# Altium schematic sheet D737343.SchDoc
size 594 x 420 mm; CompanyName: АО "Диаконт"; SheetTotal: 1; PageSetup: Record=PageOptions|CenterHorizontal=False|CenterVertical=False|PrintScale=1.00|XCorrection=0.00|YCorrection=0.00|PrintKind=2|BorderSize=5000000|LeftOffset=0|BottomOffset=0|Orientation=2|PaperLength=1000|PaperWidth=1000|Scale=100|PaperSource=7|PrintQuality=300|MediaType=1|DitherType=10|PaperKind=A2|PrintScaleMode=0; DecimalNumber: ИТЦЯ.468353.038 Э3; HeadOfSector: Нач. сектора; MainDevice: ИТЦЯ.468353.038; Name1: Плата сопряжения; Name2: пирометра; Name: Наименование; SoglasGrafa: Соглас.
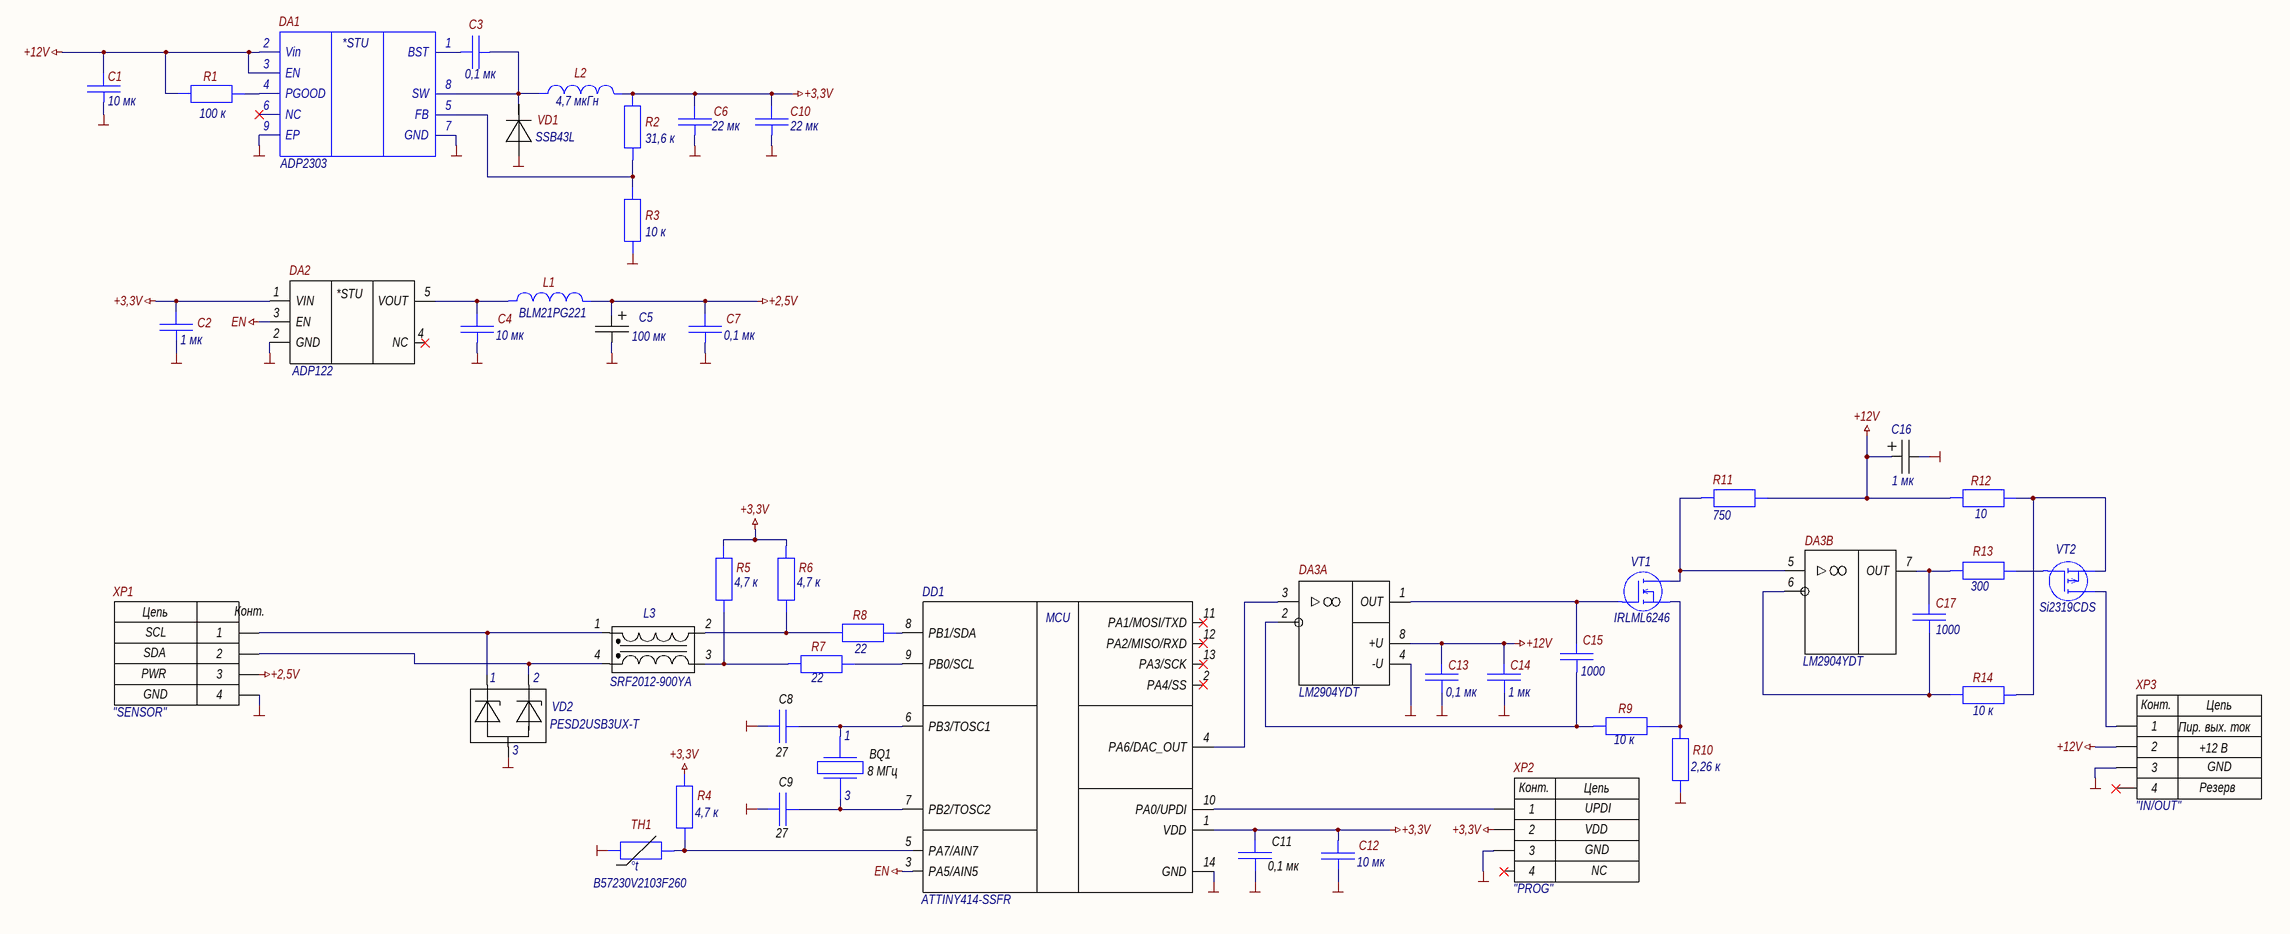
[diagram p0: D737343.SchDoc]

## Parts
BQ1  8 МГц  pinName1: 1  pinName3: 3
C1  10 мк
C2  1 мк
C3  0,1 мк
C4  10 мк
C5  100 мк
C6  22 мк
C7  0,1 мк
C8  27
C9  27
C10  22 мк
C11  0,1 мк
C12  10 мк
C13  0,1 мк
C14  1 мк
C15  1000
C16  1 мк
C17  1000
DA1  ADP2303  Function: *STU
DA2  ADP122
DA3  LM2904YDT  (parts A,B of 2)
DD1  ATTINY414-SSFR
L1  BLM21PG221
L2  value 4,7 мкГн  (hidden comment: 8RHB)
L3  SRF2012-900YA
R1  100 к
R2  31,6 к
R3  10 к
R4  4,7 к
R5  4,7 к
R6  4,7 к
R7  22
R8  22
R9  10 к
R10  2,26 к
R11  750
R12  10
R13  300
R14  10 к
TH1  B57230V2103F260
VD1  SSB43L
VD2  PESD2USB3UX-T  NamePin1: 1  NamePin2: 2  NamePin3: 3  [SOT23]
VT1  IRLML6246
VT2  Si2319CDS
XP1  "SENSOR"  1 circuit: SCL  2 circuit: GND  3 circuit: PWR  4 circuit: SDA
XP2  "PROG"  1 circuit: UPDI  2 circuit: NC  3 circuit: VDD  4 circuit: GND
XP3  "IN/OUT"  1 circuit: Пир. вых. ток  2 circuit: GND  3 circuit: +12 В  4 circuit: Резерв

## Nets
+2,5V: C5.+ C7.2 L1.2 XP1.3
+3,3V: C2.2 C6.2 C10.2 C11.2 C12.2 DA2.1(VIN) DD1.1(VDD) L2.2 R2.2 R4.1 R5.1 R6.1 XP2.2
+12V: C1.2 C13.1 C14.1 C16.+ DA1.2(Vin) DA1.3(EN) DA3.8(+U) R1.1 R11.1 R12.2 XP3.2
EN: DA2.3(EN) DD1.3(PA5/AIN5)
GND: BQ1.2 BQ1.4 C1.1 C2.1 C4.1 C5._ C6.1 C7.1 C8.1 C9.1 C10.1 C11.1 C12.1 C13.2 C14.2 C16._ DA1.7(GND) DA1.9(EP) DA2.2(GND) DA3.4(-U) DD1.14(GND) R3.1 R10.1 TH1.1 VD1.1 VD2.CA XP1.4 XP2.3 XP3.3
NetBQ1_1: BQ1.1 C8.2 DD1.6(PB3/TOSC1)
NetBQ1_3: BQ1.3 C9.2 DD1.7(PB2/TOSC2)
NetC3_1: C3.1 DA1.8(SW) L2.1 VD1.3
NetC3_2: C3.2 DA1.1(BST)
NetC4_2: C4.2 DA2.5(VOUT) L1.1
NetC15_1: C15.1 DA3.1(OUT) VT1.G(Gate)
NetC15_2: C15.2 DA3.2 R9.1
NetC17_1: C17.1 DA3.7(OUT) R13.1
NetC17_2: C17.2 DA3.6 R14.1
NetDA1_4: DA1.4(PGOOD) R1.2
NetDA1_5: DA1.5(FB) R2.1 R3.2
NetDA3_3: DA3.3 DD1.4(PA6/DAC_OUT)
NetDA3_5: DA3.5 R11.2 VT1.D(Drain)
NetDD1_5: DD1.5(PA7/AIN7) R4.2 TH1.2
NetDD1_8: DD1.8(PB1/SDA) R8.1
NetDD1_9: DD1.9(PB0/SCL) R7.1
NetDD1_10: DD1.10(PA0/UPDI) XP2.1
NetL3_1: L3.1 VD2.K1 XP1.1
NetL3_2: L3.2 R6.2 R8.2
NetL3_3: L3.3 R5.2 R7.2
NetL3_4: L3.4 VD2.K2 XP1.2
NetR9_2: R9.2 R10.2 VT1.S(Source)
NetR12_1: R12.1 R14.2 VT2.S(Source)
NetR13_2: R13.2 VT2.G(Gate)
NetVT2_D: VT2.D(Drain) XP3.1

Not connected (* = marked no-connect by the designer): DA1 6(NC)*; DA2 4(NC)*; DD1 2(PA4/SS)* 11(PA1/MOSI/TXD)* 12(PA2/MISO/RXD)* 13(PA3/SCK)*; VD1 2; XP2 4*; XP3 4*

## Notes on the sheet
- Перв.примен.
- Справ.№
- Подп. и дата
- Инв.№ дубл.
- Взам.инв.№
- Подп.и дата
- Разраб.
- Изм.
- Лист
- № докум.
- Подп.
- Дата
- Лит.
- Масштаб
- Масса
- Пров.
- Схема электрическая принципиальная
- Листов
- Инв.№ подл.
- Утв.
- Н.контр.
- Копировал
- Формат  A2
- (in symbol ADP122) *STU
- (in symbol ATtiny414 SO-14) MCU
- (in symbol Разъем PLS2  4 PIN) Цепь; Конт.
- (in symbol Термистор) °t

## Library data of the parts
BQ1 = ZQ: ABM8AIG-16.000MHZ-4-T
C1-C4 C6 C7 C10 C12 = C1
C5 C16 = Cap Tantal: TAJ_SMD; Value: {Value}
C8 C9 C11 = C: Capacitor
  C8 C9: Value: 27
  C11: Value: 0,1 мк
C13-C15 C17 = C
DA2 = ADP122: LDO Lownoise, 2.5V, 300 mA
DA3 = AD712JR
DD1 = ATtiny414 SO-14
L1 = Ferrite Bead: Ferrite Bead 0805; Value: 4,7 мкГн
L2 = 8RHB: Дроссель 8RHB
L3 = Синфазный дроссель
R1-R14 = R
TH1 = Термистор: Thermistor
VD1 = BAS20: Value: {Value}
VD2 = PESD2USB3UX-T: ESD 3.3V protection SOT23; Value: {Value}
VT1 = Полевой транзистор N-типа: MOSFET N-channel
VT2 = Полевой транзистор P-типа: MOSFET P-channel
XP1-XP3 = Разъем PLS2  4 PIN